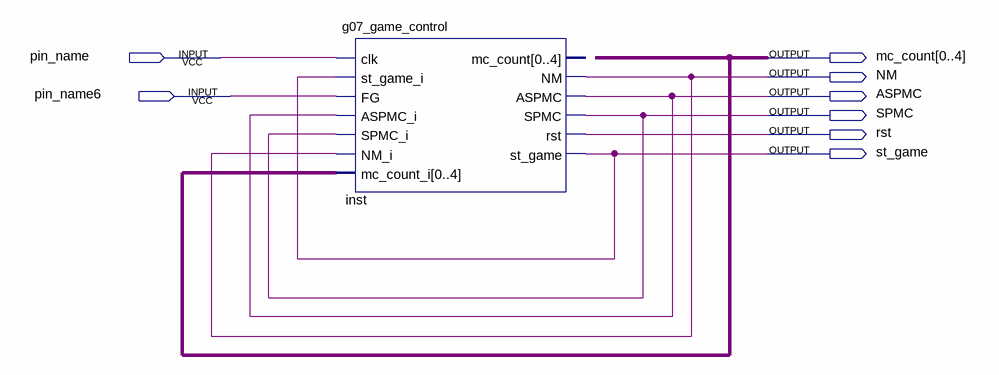
[diagram p0: schematic sheet]
// Quartus schematic g07_game_control.bdf as structural Verilog: 1 symbols, 8 pins
module g07_game_control (
  input  pin_name,
  input  pin_name6,
  output [0:4] mc_count,
  output NM,
  output ASPMC,
  output SPMC,
  output rst,
  output st_game
);

  g07_game_control inst (
    .clk(pin_name), .st_game_i(st_game), .FG(pin_name6), .ASPMC_i(ASPMC), .SPMC_i(SPMC), .NM_i(NM),
    .mc_count_i(mc_count), .NM(NM), .ASPMC(ASPMC), .SPMC(SPMC), .rst(rst), .st_game(st_game));  // open: mc_count
endmodule
